# EAGLE design module (EAGLE 7.7.0)
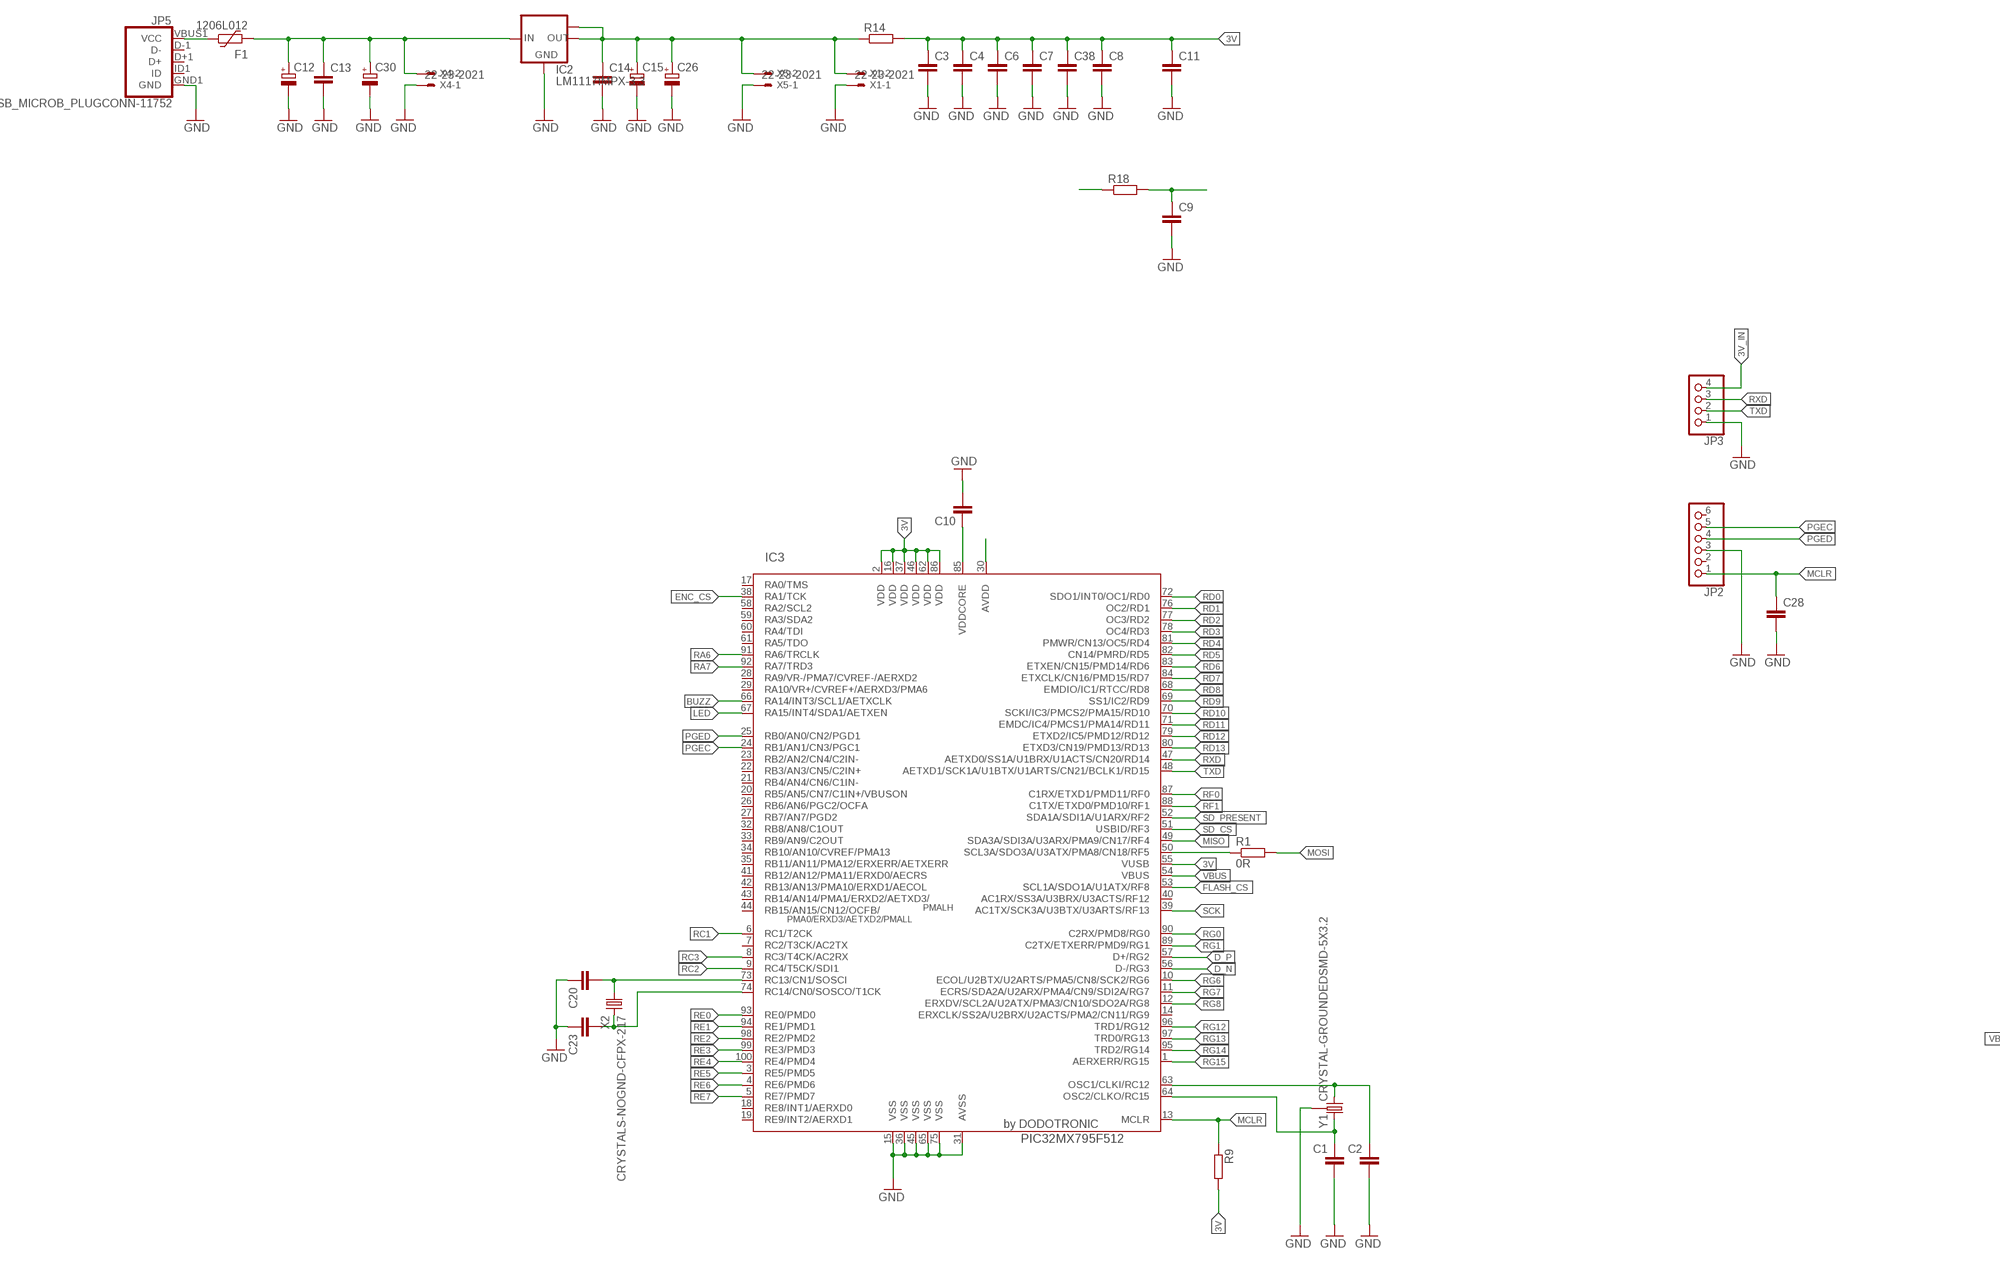
[diagram p0: schematic, sheet 1, part 1 of 3]
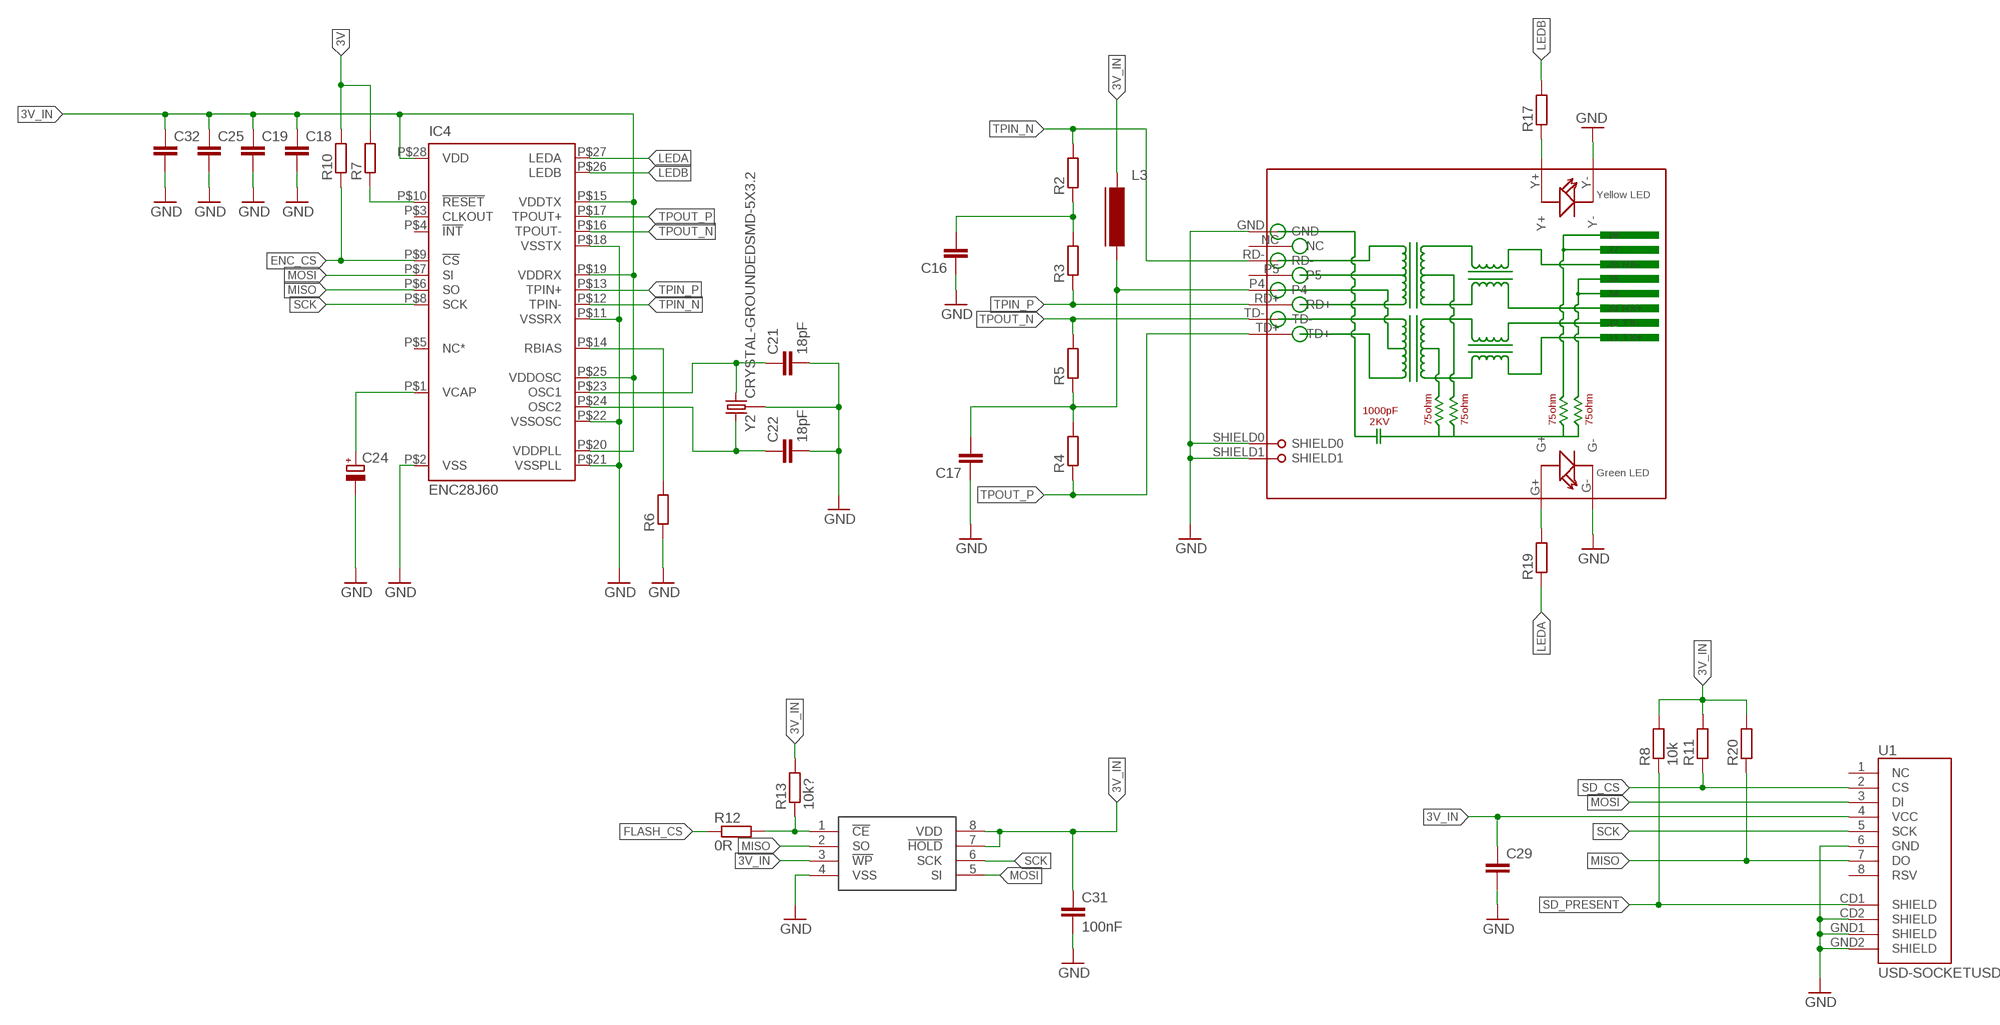
[diagram p1: schematic, sheet 1, part 2 of 3]
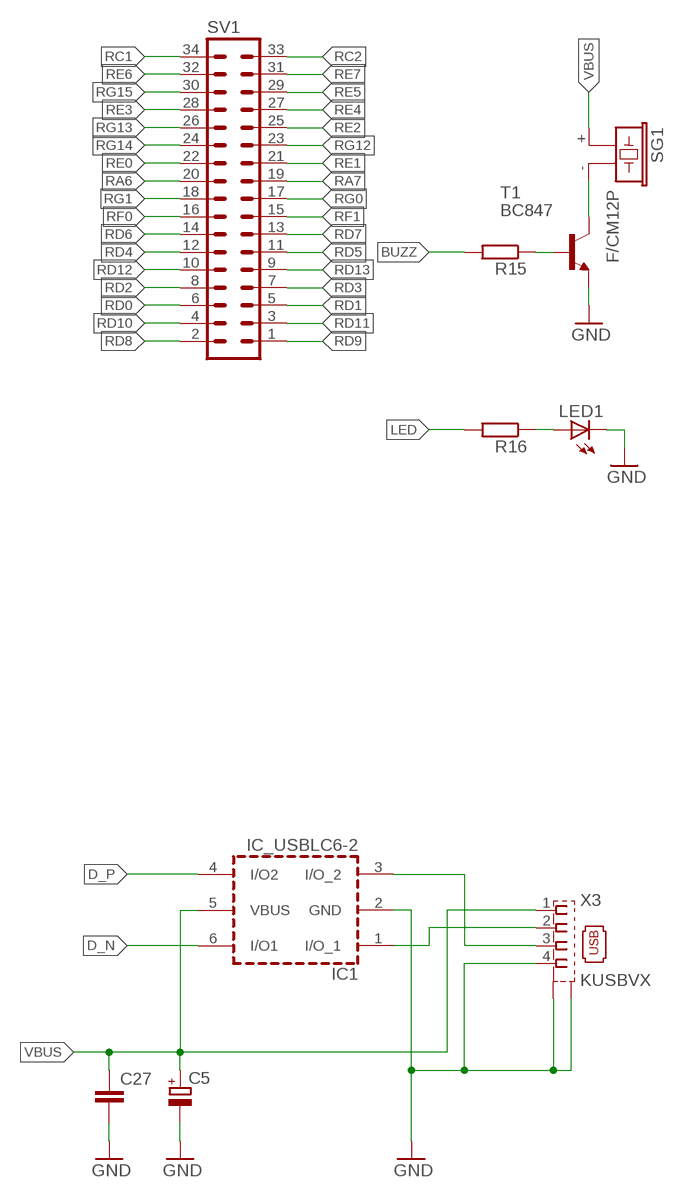
[diagram p2: schematic, sheet 1, part 3 of 3]

## Parts
C1  C-EUC0603  [C0603]
C2  C-EUC0603  [C0603]
C3  C-EUC0402  [C0402]
C4  C-EUC0402  [C0402]
C5  CPOL-EUSMCA  [SMC_A]
C6  C-EUC0402  [C0402]
C7  C-EUC0402  [C0402]
C8  C-EUC0402  [C0402]
C9  C-EUC0402  [C0402]
C10  C-EUC0603  [C0603]
C11  C-EUC0402  [C0402]
C12  CPOL-EUSMCB  [SMC_B]
C13  C-EUC0603  [C0603]
C14  C-EUC0603  [C0603]
C15  CPOL-EUSMCB  [SMC_B]
C16  C-EUC0603  [C0603]
C17  C-EUC0603  [C0603]
C18  C-EUC0402  [C0402]
C19  C-EUC0603  [C0603]
C20  C-EUC0603  [C0603]
C21  18pF  C-EUC0603  [C0603]
C22  18pF  C-EUC0603  [C0603]
C23  C-EUC0603  [C0603]
C24  CPOL-EUSMCA  [SMC_A]
C25  C-EUC0603  [C0603]
C26  CPOL-EUSMCA  [SMC_A]
C27  C-EUC0603  [C0603]
C28  C-EUC0603  [C0603]
C29  C-EUC0603  [C0603]
C30  CPOL-EUSMCA  [SMC_A]
C31  100nF  C-EUC0603  [C0603]
C32  C-EUC0402  [C0402]
C38  C-EUC0603  [C0603]
F1  1206L012  [1206L]
IC1  IC_USBLC6-2  [SOT-23-6L]
IC2  LM1117IMPX-3.3  [SOT223]
IC3  PIC32MX795F512  [TQFP100_12X12]
IC4  ENC28J60  [TSSOP28W]
JP2  PINHD-1X6  [1X06]
JP3  PINHD-1X4  [1X04]
JP5  USB_MICROB_PLUGCONN-11752  [USB-B-MICRO-SMD_V03]
L3  FERRITE-0805  [FB805]
LED1  LED3MM  [LED3MM]
R1  0R  R-EU_R0603  [R0603]
R2  R-EU_R0603  [R0603]
R3  R-EU_R0603  [R0603]
R4  R-EU_R0603  [R0603]
R5  R-EU_R0603  [R0603]
R6  R-EU_R0805  [R0805]
R7  R-EU_R0402  [R0402]
R8  10k  R-EU_R0603  [R0603]
R9  R-EU_R0603  [R0603]
R10  R-EU_R0603  [R0603]
R11  R-EU_R0603  [R0603]
R12  0R  R-EU_R0603  [R0603]
R13  10k?  R-EU_R0603  [R0603]
R14  R-EU_R1206  [R1206]
R15  R-EU_R0603  [R0603]
R16  R-EU_R0603  [R0603]
R17  R-EU_R1206  [R1206]
R18  R-EU_R0805  [R0805]
R19  R-EU_R1206  [R1206]
R20  R-EU_R0603  [R0603]
RJ1  HR911105A  [HR911105A]
SG1  F/CM12P  [F/CM12P]
SV1  ML34L  [ML34L]
T1  BC847  [SOT23]
U1  USD-SOCKETUSD  [USD-SOCKET-PP]
U$2  SST25VF016BSO8M  [SO-08M]
X1  22-23-2021  [22-23-2021]
X2  CRYSTALS-NOGND-CFPX-217  [3.2X1.5-2-PAD]
X3  KUSBVX  [KUSBVX]
X4  22-23-2021  [22-23-2021]
X5  22-23-2021  [22-23-2021]
Y1  CRYSTAL-GROUNDEDSMD-5X3.2  [CRYSTAL-SMD-5X3.2-4PAD]
Y2  CRYSTAL-GROUNDEDSMD-5X3.2  [CRYSTAL-SMD-5X3.2-4PAD]

## Nets
3V: C3.1 C4.1 C6.1 C7.1 C8.1 C11.1 C38.1 IC3.2(VDD) IC3.16(VDD) IC3.37(VDD) IC3.46(VDD) IC3.55(VUSB) IC3.62(VDD) IC3.86(VDD) R7.2 R9.2 R10.2 R14.2 R18.1
3V_IN: C14.1 C15.+ C18.1 C19.1 C25.1 C26.+ C29.1 C31.1 C32.1 IC2.2(OUT) IC2.TAB(OUT1) IC4.P$15(VDDTX) IC4.P$19(VDDRX) IC4.P$20(VDDPLL) IC4.P$25(VDDOSC) IC4.P$28(VDD) JP3.4 L3.1 R8.2 R11.2 R13.2 R14.1 R20.2 U1.4(VCC) U$2.3(!WP) U$2.7(!HOLD) U$2.8(VDD) X1.2 X5.2
AN_3V: C9.1 IC3.30(AVDD) R18.2
BUZZ: IC3.66(RA14/INT3/SCL1/AETXCLK) R15.2
CE1: R12.2 R13.1 U$2.1(!CE)
D2_N: IC1.1(I/O_1) X3.2
D2_P: IC1.3(I/O_2) X3.3
D_N: IC1.6(I/O1) IC3.56(D-/RG3)
D_P: IC1.4(I/O2) IC3.57(D+/RG2)
ENC_CS: IC3.38(RA1/TCK) IC4.P$9(!CS) R10.1
ENC_RST: IC4.P$10(!RESET) R7.1
FLASH_CS: IC3.53(SCL1A/SDO1A/U1ATX/RF8) R12.1
GND: C1.2 C2.2 C3.2 C4.2 C5.- C6.2 C7.2 C8.2 C9.2 C10.2 C11.2 C12.- C13.2 C14.2 C15.- C16.1 C17.1 C18.2 C19.2 C20.1 C21.2 C22.2 C23.1 C24.- C25.2 C26.- C27.2 C28.2 C29.2 C30.- C31.2 C32.2 C38.2 IC1.2(GND) IC2.1(GND) IC3.15(VSS) IC3.31(AVSS) IC3.36(VSS) IC3.45(VSS) IC3.65(VSS) IC3.75(VSS) IC4.P$2(VSS) IC4.P$11(VSSRX) IC4.P$18(VSSTX) IC4.P$21(VSSPLL) IC4.P$22(VSSOSC) JP2.3 JP3.1 JP5.GND1(GND) LED1.K(C) R6.1 RJ1.G- RJ1.GND RJ1.SHIELD0 RJ1.SHIELD1 RJ1.Y- T1.2(E) U1.6(GND) U1.CD2(SHIELD) U1.GND1(SHIELD) U1.GND2(SHIELD) U$2.4(VSS) X1.1 X3.4 X3.M1(S1) X3.M2(S2) X4.1 X5.1 Y1.2 Y1.4 Y2.2 Y2.4
LED: IC3.67(RA15/INT4/SDA1/AETXEN) R16.2
LEDA: IC4.P$27(LEDA) R19.1
LEDB: IC4.P$26(LEDB) R17.2
MCLR: C28.1 IC3.13(MCLR) JP2.1 R9.1
MISO: IC3.49(SDA3A/SDI3A/U3ARX/PMA9/CN17/RF4) IC4.P$6(SO) R20.1 U1.7(DO) U$2.2(SO)
MOSI: IC4.P$7(SI) R1.2 U1.3(DI) U$2.5(SI)
N$1: SG1.- T1.3(C)
N$2: C16.2 R2.1 R3.2
N$3: R15.1 T1.1(B)
N$4: LED1.A R16.1
N$5: IC3.50(SCL3A/SDO3A/U3ATX/PMA8/CN18/RF5) R1.1
N$6: C17.2 L3.2 R4.2 R5.1 RJ1.P4
N$10: C10.1 IC3.85(VDDCORE)
N$12: IC4.P$14(RBIAS) R6.2
N$17: F1.1 JP5.VBUS1(VCC)
N$22: C21.1 IC4.P$23(OSC1) Y2.1
N$23: C22.1 IC4.P$24(OSC2) Y2.3
N$29: C24.+ IC4.P$1(VCAP)
N$30: R17.1 RJ1.Y+
N$31: R19.2 RJ1.G+
OSC1: C2.1 IC3.63(OSC1/CLKI/RC12) Y1.1
OSC2: C1.1 IC3.64(OSC2/CLKO/RC15) Y1.3
PGEC: IC3.24(RB1/AN1/CN3/PGC1) JP2.5
PGED: IC3.25(RB0/AN0/CN2/PGD1) JP2.4
RA6: IC3.91(RA6/TRCLK) SV1.20
RA7: IC3.92(RA7/TRD3) SV1.19
RC1: IC3.6(RC1/T2CK) SV1.34
RC2: IC3.9(RC4/T5CK/SDI1) SV1.33
RC3: IC3.8(RC3/T4CK/AC2RX)
RD0: IC3.72(SDO1/INT0/OC1/RD0) SV1.6
RD1: IC3.76(OC2/RD1) SV1.5
RD2: IC3.77(OC3/RD2) SV1.8
RD3: IC3.78(OC4/RD3) SV1.7
RD4: IC3.81(PMWR/CN13/OC5/RD4) SV1.12
RD5: IC3.82(CN14/PMRD/RD5) SV1.11
RD6: IC3.83(ETXEN/CN15/PMD14/RD6) SV1.14
RD7: IC3.84(ETXCLK/CN16/PMD15/RD7) SV1.13
RD8: IC3.68(EMDIO/IC1/RTCC/RD8) SV1.2
RD9: IC3.69(SS1/IC2/RD9) SV1.1
RD10: IC3.70(SCKI/IC3/PMCS2/PMA15/RD10) SV1.4
RD11: IC3.71(EMDC/IC4/PMCS1/PMA14/RD11) SV1.3
RD12: IC3.79(ETXD2/IC5/PMD12/RD12) SV1.10
RD13: IC3.80(ETXD3/CN19/PMD13/RD13) SV1.9
RE0: IC3.93(RE0/PMD0) SV1.22
RE1: IC3.94(RE1/PMD1) SV1.21
RE2: IC3.98(RE2/PMD2) SV1.25
RE3: IC3.99(RE3/PMD3) SV1.28
RE4: IC3.100(RE4/PMD4) SV1.27
RE5: IC3.3(RE5/PMD5) SV1.29
RE6: IC3.4(RE6/PMD6) SV1.32
RE7: IC3.5(RE7/PMD7) SV1.31
RF0: IC3.87(C1RX/ETXD1/PMD11/RF0) SV1.16
RF1: IC3.88(C1TX/ETXD0/PMD10/RF1) SV1.15
RG0: IC3.90(C2RX/PMD8/RG0) SV1.17
RG1: IC3.89(C2TX/ETXERR/PMD9/RG1) SV1.18
RG6: IC3.10(ECOL/U2BTX/U2ARTS/PMA5/CN8/SCK2/RG6)
RG7: IC3.11(ECRS/SDA2A/U2ARX/PMA4/CN9/SDI2A/RG7)
RG8: IC3.12(ERXDV/SCL2A/U2ATX/PMA3/CN10/SDO2A/RG8)
RG12: IC3.96(TRD1/RG12) SV1.23
RG13: IC3.97(TRD0/RG13) SV1.26
RG14: IC3.95(TRD2/RG14) SV1.24
RG15: IC3.1(AERXERR/RG15) SV1.30
RXD: IC3.47(AETXD0/SS1A/U1BRX/U1ACTS/CN20/RD14) JP3.3
SCK: IC3.39(AC1TX/SCK3A/U3BTX/U3ARTS/RF13) IC4.P$8(SCK) U1.5(SCK) U$2.6(SCK)
SD_CS: IC3.51(USBID/RF3) R11.1 U1.2(CS)
SD_PRESENT: IC3.52(SDA1A/SDI1A/U1ARX/RF2) R8.1 U1.CD1(SHIELD)
SOSCI: C20.2 IC3.73(RC13/CN1/SOSCI) X2.1
SOSCO: C23.2 IC3.74(RC14/CN0/SOSCO/T1CK) X2.2
TPIN_N: IC4.P$12(TPIN-) R2.2 RJ1.RD-
TPIN_P: IC4.P$13(TPIN+) R3.1 RJ1.RD+
TPOUT_N: IC4.P$16(TPOUT-) R5.2 RJ1.TD-
TPOUT_P: IC4.P$17(TPOUT+) R4.1 RJ1.TD+
TXD: IC3.48(AETXD1/SCK1A/U1BTX/U1ARTS/CN21/BCLK1/RD15) JP3.2
VBUS: C5.+ C12.+ C13.1 C27.1 C30.+ F1.2 IC1.5(VBUS) IC2.3(IN) IC3.54(VBUS) SG1.+ X3.1 X4.2
Unconnected: IC3.7(RC2/T3CK/AC2TX) IC3.14(ERXCLK/SS2A/U2BRX/U2ACTS/PMA2/CN11/RG9) IC3.17(RA0/TMS) IC3.18(RE8/INT1/AERXD0) IC3.19(RE9/INT2/AERXD1) IC3.20(RB5/AN5/CN7/C1IN+/VBUSON) IC3.21(RB4/AN4/CN6/C1IN-) IC3.22(RB3/AN3/CN5/C2IN+) IC3.23(RB2/AN2/CN4/C2IN-) IC3.26(RB6/AN6/PGC2/OCFA) IC3.27(RB7/AN7/PGD2) IC3.28(RA9/VR-/PMA7/CVREF-/AERXD2) IC3.29(RA10/VR+/CVREF+/AERXD3/PMA6) IC3.32(RB8/AN8/C1OUT) IC3.33(RB9/AN9/C2OUT) IC3.34(RB10/AN10/CVREF/PMA13) IC3.35(RB11/AN11/PMA12/ERXERR/AETXERR) IC3.40(AC1RX/SS3A/U3BRX/U3ACTS/RF12) IC3.41(RB12/AN12/PMA11/ERXD0/AECRS) IC3.42(RB13/AN13/PMA10/ERXD1/AECOL) IC3.43(RB14/AN14/PMA1/ERXD2/AETXD3/) IC3.44(RB15/AN15/CN12/OCFB/) IC3.58(RA2/SCL2) IC3.59(RA3/SDA2) IC3.60(RA4/TDI) IC3.61(RA5/TDO) IC4.P$3(CLKOUT) IC4.P$4(!INT) IC4.P$5(NC*) JP2.2 JP2.6 JP5.D+1(D+) JP5.D-1(D-) JP5.ID1(ID) RJ1.NC RJ1.P5 U1.1(NC) U1.8(RSV)

## Library data of the parts
C1-C4 C6-C11 C13 C14 C16-C23 C25 C27-C29 C31 C32 C38 = rcl:C-EU: CAPACITOR, European symbol
C5 C12 C15 C24 C26 C30 = rcl:CPOL-EU: POLARIZED CAPACITOR, European symbol
F1 = polyfuse-smd_10:?: Polyfuse Resettable PTC Source: http://www.littelfuse.com/products/resettable-ptcs.aspx; MF: Littelfuse; MPN: 1206L012; OC_FARNELL: 1596988; OC_NEWARK: 05M2298
IC1 = dp_devices:IC_USBLC6-2
IC2 = lm1117:LM1117IMPX-*
IC3 = DodoMicroR3:PIC32MX795F512: USB, CAN and Ethernet 32-bit Flash Microcontroller
IC4 = microchip:ENC28J60: Stand-Alone Ethernet Controller with SPI Interface Source: http://ww1.microchip.com/downloads/en/DeviceDoc/39662c.pdf
JP2 = pinhead:PINHD-1X6: PIN HEADER
JP3 = pinhead:PINHD-1X4: PIN HEADER
JP5 = SparkFun-Connectors:USB_MICROB_PLUG: USB Micro-B connectors Some male, some female. Watch your step!; PROD_ID: CONN-11752
L3 = dp_devices:FERRITE: Ferrite bead in various packages
LED1 = led:LED: LED OSRAM: - CHIPLED LG R971, LG N971, LY N971, LG Q971, LY Q971, LO R971, LY R971 LH N974, LH R974 LS Q976, LO Q976, LY Q976 LO Q996 - Hyper CHIPLED LW Q18S LB Q993, LB Q99A, LB R99A - SideLED LS A670, LO A670, LY A670, LG A670, LP A670 LB A673, LV A673, LT A673, LW A673 LH A674 LY A675 LS A676, LA A676, LO A676, LY A676, LW A676 LS A679, LY A679, LG A679 - Hyper Micro SIDELED® LS Y876, LA Y876, LO Y876, LY Y876 LT Y87S - SmartLED LW L88C, LW L88S LB L89C, LB L89S, LG L890 LS L89K, LO L89K, LY L89K LS L896, LA L896, LO L896, LY L896 - TOPLED LS T670, LO T670, LY T670, LG T670, LP T670 LSG T670, LSP T670, LSY T670, LOP T670, LYG T670 LG T671, LOG T671, LSG T671 LB T673, LV T673, LT T673, LW T673 LH T674 LS T676, LA T676, LO T676, LY T676, LB T676, LH T676, LSB T676, LW T676 LB T67C, LV T67C, LT T67C, LS T67K, LO T67K, LY T67K, LW E67C LS E67B, LA E67B, LO E67B, LY E67B, LB E67C, LV E67C, LT E67C LW T67C LS T679, LY T679, LG T679 LS T770, LO T770, LY T770, LG T770, LP T770 LB T773, LV T773, LT T773, LW T773 LH T774 LS E675, LA E675, LY E675, LS T675 LS T776, LA T776, LO T776, LY T776, LB T776 LHGB T686 LT T68C, LB T68C - Hyper Mini TOPLED® LB M676 - Mini TOPLED Santana® LG M470 LS M47K, LO M47K, LY M47K Source: http://www.osram.convergy.de LUXEON: - LUMILED® LXK2-PW12-R00, LXK2-PW12-S00, LXK2-PW14-U00, LXK2-PW14-V00 LXK2-PM12-R00, LXK2-PM12-S00, LXK2-PM14-U00 LXK2-PE12-Q00, LXK2-PE12-R00, LXK2-PE12-S00, LXK2-PE14-T00, LXK2-PE14-U00 LXK2-PB12-K00, LXK2-PB12-L00, LXK2-PB12-M00, LXK2-PB14-N00, LXK2-PB14-P00, LXK2-PB14-Q00 LXK2-PR12-L00, LXK2-PR12-M00, LXK2-PR14-Q00, LXK2-PR14-R00 LXK2-PD12-Q00, LXK2-PD12-R00, LXK2-PD12-S00 LXK2-PH12-R00, LXK2-PH12-S00 LXK2-PL12-P00, LXK2-PL12-Q00, LXK2-PL12-R00 Source: www.luxeon.com KINGBRIGHT: KA-3528ASYC Source: www.kingbright.com
R1-R20 = rcl:R-EU_: RESISTOR, European symbol
RJ1 = hanrun:HR911105A
SG1 = buzzer:F/CM12P: BUZZER Source: Buerklin; OC_FARNELL: unknown; OC_NEWARK: unknown
SV1 = con-harting-ml:ML34: HARTING; OC_FARNELL: unknown; OC_NEWARK: unknown
T1 = transistor:BC847: NPN TRANSISTOR
U1 = SparkFun-Connectors:USD-SOCKET: microSD Socket Push-push type uSD socket. Schematic element and footprint production proven. Spark Fun Electronics SKU : PRT-00127. tDoc lines correctly indicate media card edge positions when inserting (unlocked, locked, depressed).
U$2 = mw:SST25VF016B
X1 X4 X5 = con-molex:22-23-2021: .100" (2.54mm) Center Header - 2 Pin; MF: MOLEX; MPN: 22-23-2021; OC_FARNELL: 1462926; OC_NEWARK: 25C3832
X2 = IQD-Frequency-Products:CRYSTALS-NOGND: CRYSTALS CAN NOT GROUNDED
X3 = con-kycon:KUSBVX: Vertical,Top Entry Universal Serial Bus Connector KUSBVX Series Source: KYCON Sibalco USB vertical socket KUSBV.pdf
Y1 Y2 = SparkFun-Clocks:CRYSTAL-GROUNDED: Crystals w/ Ground Pin (Generic) These are passive quartz crystals, which can be used as a clock source for a microcontroller. Crystal's are usually two-terminal devices. A third terminal may be optionally connected to ground, as recommended by the manufaturer.

## Board
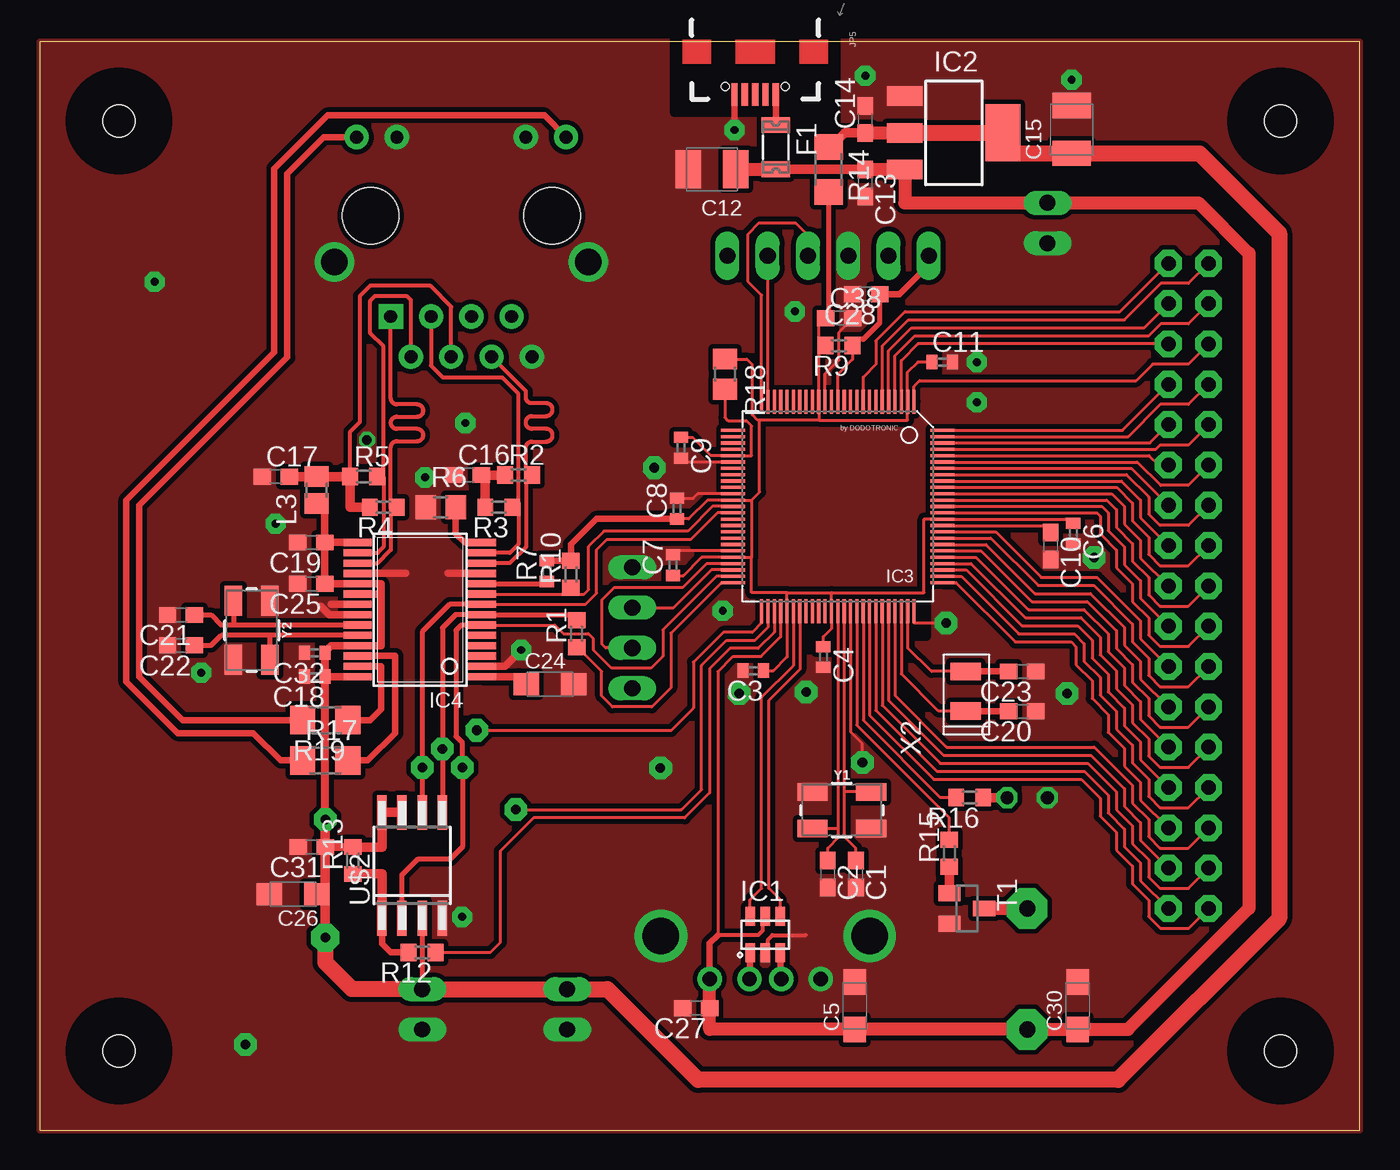
[diagram p3: board, top side]
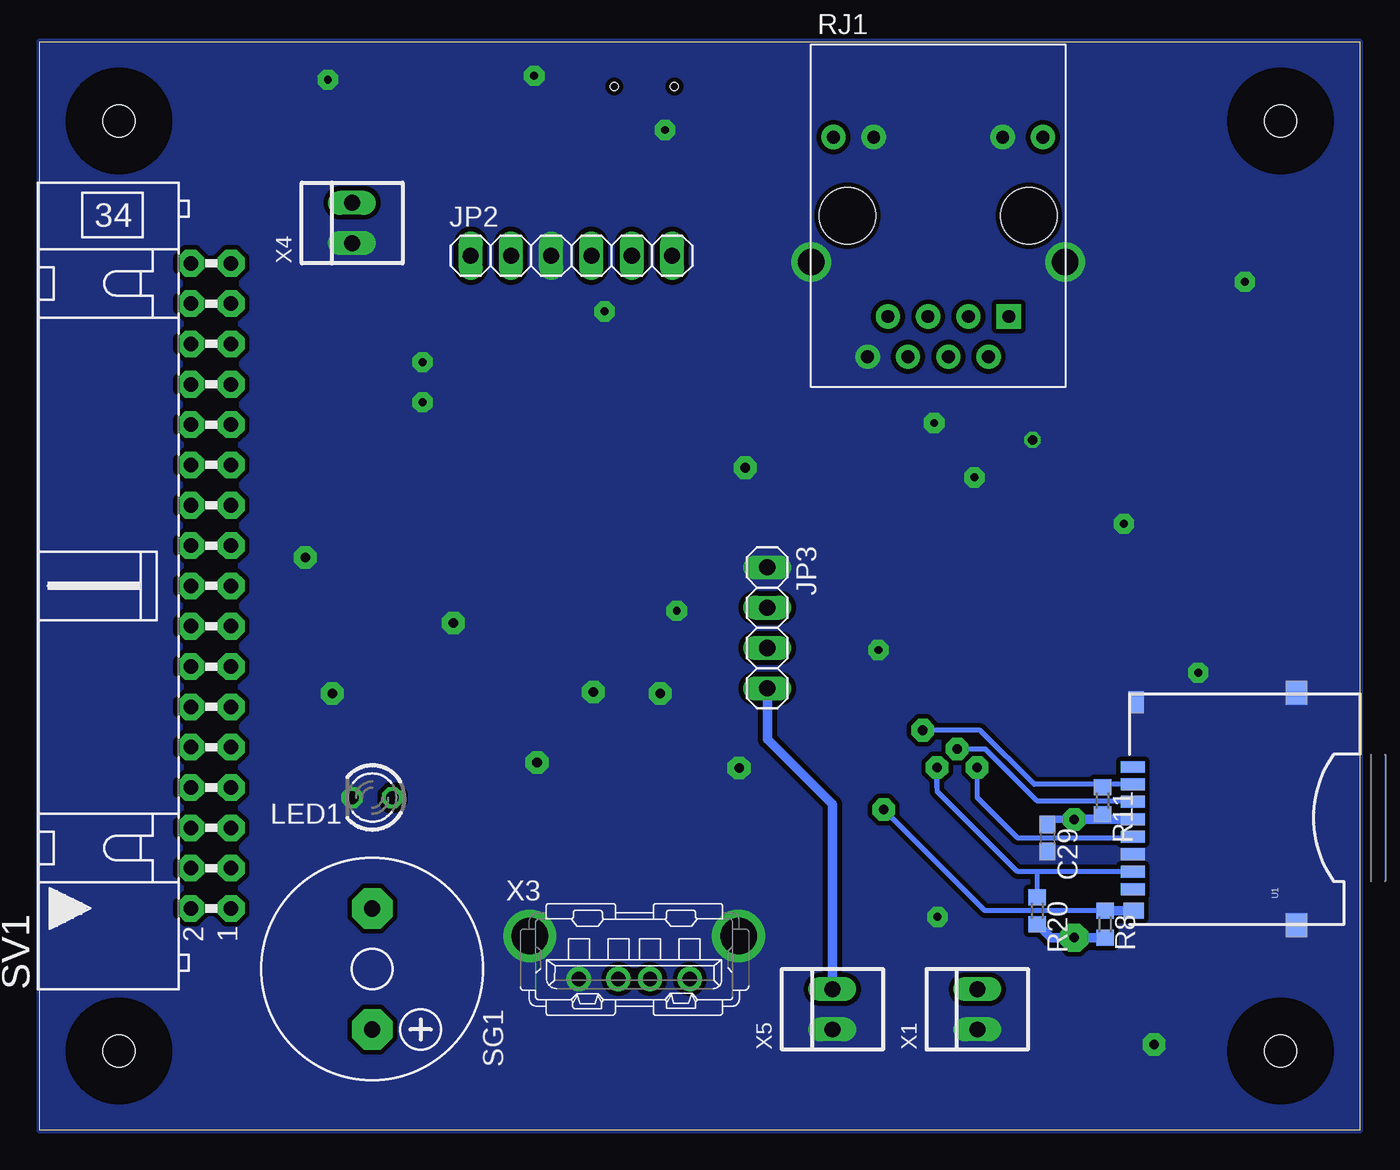
[diagram p4: board, bottom side, seen from below]

Size 83.19 x 68.58 mm. Coordinates in mm from the lower left corner, seen from the top.
Outline: 0,0 83.19,0 83.19,68.58 0,68.58 0,0
Copper layers (1*16): Top 0.035mm / dielectric 1.5mm / Bottom 0.035mm
Design rules "default *": minimum track width 10mil, minimum drill 24mil, track to track 8mil, track to pad 8mil, pad to pad 8mil, via to via 8mil, smd to smd 8mil, copper to edge 0mil, drill to drill 8mil, minimum pad ring 10mil, minimum via ring 8mil, stop-mask expansion 4mil, vias tented up to drill 0mil, thermal gap 10mil
Holes 2 mm at 5,5 78.19,5 78.19,63.58 5,63.58
tRestrict: area 55.1,31.1 to 55.9,33.9; area 44.5,11.4 to 47,13.3; area 19.1,28.3 to 20.9,37.3; area 27,28.3 to 28.8,37.3; area 41.3,36.8 to 43.2,37.5; area 45.5,61 to 47.3,62.8; area 40,64.1 to 50.2,68.6; area 47.6,61 to 50.2,64.1; area 2,2 to 8,8; area 75.1,2 to 81.2,8; area 75.1,60.5 to 81.2,66.6; area 2,60.5 to 8,66.6
bRestrict: area 2,2 to 8,8; area 75.1,2 to 81.2,8; area 75.1,60.5 to 81.2,66.6; area 2,60.5 to 8,66.6

### Footprints (pad centres in the part's own frame; a part is rotated, then mirrored left to right if it is on the bottom)
C0603 = smd 1.1 x 1: 1 -0.85,0; 2 0.85,0
C0402 = smd 0.7 x 0.9: 1 -0.65,0; 2 0.65,0
SMC_A = smd 1.6 x 1.4: + -1.5,0; - 1.5,0
SMC_B = smd 1.6 x 2.4: + -1.5,0; - 1.5,0
1206L = smd 1 x 1.8: 1 -1.4,0; 2 1.4,0
SOT-23-6L = smd 0.6 x 1.2: 1 -0.95,-2.3; 2 0,-2.3; 3 0.95,-2.3; 4 0.95,0; 5 0,0; 6 -0.95,0
SOT223 = smd 1.219 x 2.235: 1 -2.311,-3.099; 2 0,-3.099; 3 2.311,-3.099 | smd 3.6 x 2.2: TAB 0,3.099
TQFP100_12X12 = smd 0.2 x 1.5: 1 -4.8,-6.6; 2 -4.4,-6.6; 3 -4,-6.6; 4 -3.6,-6.6; 5 -3.2,-6.6; 6 -2.8,-6.6; 7 -2.4,-6.6; 8 -2,-6.6; 9 -1.6,-6.6; 10 -1.2,-6.6; 11 -0.8,-6.6; 12 -0.4,-6.6; 13 0,-6.6; 14 0.4,-6.6; 15 0.8,-6.6; 16 1.2,-6.6; 17 1.6,-6.6; 18 2,-6.6; 19 2.4,-6.6; 20 2.8,-6.6; 21 3.2,-6.6; 22 3.6,-6.6; 23 4,-6.6; 24 4.4,-6.6; 25 4.8,-6.6; 51 4.8,6.6; 52 4.4,6.6; 53 4,6.6; 54 3.6,6.6; 55 3.2,6.6; 56 2.8,6.6; 57 2.4,6.6; 58 2,6.6; 59 1.6,6.6; 60 1.2,6.6; 61 0.8,6.6; 62 0.4,6.6; 63 0,6.6; 64 -0.4,6.6; 65 -0.8,6.6; 66 -1.2,6.6; 67 -1.6,6.6; 68 -2,6.6; 69 -2.4,6.6; 70 -2.8,6.6; 71 -3.2,6.6; 72 -3.6,6.6; 73 -4,6.6; 74 -4.4,6.6; 75 -4.8,6.6 | smd 1.5 x 0.2: 26 6.6,-4.8; 27 6.6,-4.4; 28 6.6,-4; 29 6.6,-3.6; 30 6.6,-3.2; 31 6.6,-2.8; 32 6.6,-2.4; 33 6.6,-2; 34 6.6,-1.6; 35 6.6,-1.2; 36 6.6,-0.8; 37 6.6,-0.4; 38 6.6,0; 39 6.6,0.4; 40 6.6,0.8; 41 6.6,1.2; 42 6.6,1.6; 43 6.6,2; 44 6.6,2.4; 45 6.6,2.8; 46 6.6,3.2; 47 6.6,3.6; 48 6.6,4; 49 6.6,4.4; 50 6.6,4.8; 76 -6.6,4.8; 77 -6.6,4.4; 78 -6.6,4; 79 -6.6,3.6; 80 -6.6,3.2; 81 -6.6,2.8; 82 -6.6,2.4; 83 -6.6,2; 84 -6.6,1.6; 85 -6.6,1.2; 86 -6.6,0.8; 87 -6.6,0.4; 88 -6.6,0; 89 -6.6,-0.4; 90 -6.6,-0.8; 91 -6.6,-1.2; 92 -6.6,-1.6; 93 -6.6,-2; 94 -6.6,-2.4; 95 -6.6,-2.8; 96 -6.6,-3.2; 97 -6.6,-3.6; 98 -6.6,-4; 99 -6.6,-4.4; 100 -6.6,-4.8
TSSOP28W = smd 0.45 x 1.75: P$1 0,-0.65; P$2 0.65,-0.65; P$3 1.3,-0.65; P$4 1.95,-0.65; P$5 2.6,-0.65; P$6 3.25,-0.65; P$7 3.9,-0.65; P$8 4.55,-0.65; P$9 5.2,-0.65; P$10 5.85,-0.65; P$11 6.5,-0.65; P$12 7.15,-0.65; P$13 7.8,-0.65; P$14 8.45,-0.65; P$15 8.45,7.2; P$16 7.8,7.2; P$17 7.15,7.2; P$18 6.5,7.2; P$19 5.85,7.2; P$20 5.2,7.2; P$21 4.55,7.2; P$22 3.9,7.2; P$23 3.25,7.2; P$24 2.6,7.2; P$25 1.95,7.2; P$26 1.3,7.2; P$27 0.65,7.2; P$28 0,7.2
1X06 = drill 1.016 long: 1 -6.35,0; 2 -3.81,0; 3 -1.27,0; 4 1.27,0; 5 3.81,0; 6 6.35,0
1X04 = drill 1.016 long: 1 -3.81,0; 2 -1.27,0; 3 1.27,0; 4 3.81,0
USB-B-MICRO-SMD_V03 = smd 1.4 x 0.4: D+1 2.7,0; D-1 2.7,0.65; GND1 2.7,-1.3; ID1 2.7,-0.65; VBUS1 2.7,1.3 | hole 0.5: 2.2,1.9; 2.2,-1.9
FB805 = smd 1.3 x 1.5: 1 -0.85,0; 2 0.85,0
LED3MM = drill 0.813 octagon: A -1.27,0; K 1.27,0
R0603 = smd 1 x 1.1: 1 -0.85,0; 2 0.85,0
R0805 = smd 1.3 x 1.5: 1 -0.95,0; 2 0.95,0
R0402 = smd 0.7 x 0.9: 1 -0.65,0; 2 0.65,0
R1206 = smd 1.6 x 1.803: 1 -1.422,0; 2 1.422,0
HR911105A = drill 0.813 pad 1.524: G+ 4.953,-6.604; G- 4.953,-4.064; GND -8.89,4.445; NC -6.35,3.175; P4 -8.89,-0.635; P5 -6.35,0.635; RD+ -6.35,-1.905; RD- -8.89,1.905; TD- -8.89,-3.175; Y+ 4.953,6.604; Y- 4.953,4.064 | drill 1.651 pad 2.159: SHIELD0 -2.921,8.001; SHIELD1 -2.921,-8.001 | drill 0.813 pad 1.524 square: TD+ -6.35,-4.445 | hole 3.556: 0,-5.715; 0,5.715
F/CM12P = drill 1.016 pad 2.54 octagon: + 3.81,0; - -3.81,0
ML34L = drill 0.914 pad 1.676 octagon: 1 -20.32,-1.27; 2 -20.32,1.27; 3 -17.78,-1.27; 4 -17.78,1.27; 5 -15.24,-1.27; 6 -15.24,1.27; 7 -12.7,-1.27; 8 -12.7,1.27; 9 -10.16,-1.27; 10 -10.16,1.27; 11 -7.62,-1.27; 12 -7.62,1.27; 13 -5.08,-1.27; 14 -5.08,1.27; 15 -2.54,-1.27; 16 -2.54,1.27; 17 0,-1.27; 18 0,1.27; 19 2.54,-1.27; 20 2.54,1.27; 21 5.08,-1.27; 22 5.08,1.27; 23 7.62,-1.27; 24 7.62,1.27; 25 10.16,-1.27; 26 10.16,1.27; 27 12.7,-1.27; 28 12.7,1.27; 29 15.24,-1.27; 30 15.24,1.27; 31 17.78,-1.27; 32 17.78,1.27; 33 20.32,-1.27; 34 20.32,1.27
SOT23 = smd 1 x 1.4: 1 -0.95,-1.1; 2 0.95,-1.1; 3 0,1.1
USD-SOCKET-PP = smd 0.75 x 1.5: 1 3.2,14.3; 2 2.1,14.3; 3 1,14.3; 4 -0.1,14.3; 5 -1.2,14.3; 6 -2.3,14.3; 7 -3.4,14.3; 8 -4.5,14.3 | smd 1 x 1.3: CD1 -5.85,14.25 | smd 1.4 x 1: CD2 7.275,14.1 | smd 1.5 x 1.35: GND1 -6.775,4; GND2 7.875,4
SO-08M = smd 0.6 x 2.2: 1 -1.905,-3.33; 2 -0.635,-3.33; 3 0.635,-3.33; 4 1.905,-3.33; 5 1.905,3.33; 6 0.635,3.33; 7 -0.635,3.33; 8 -1.905,3.33
22-23-2021 = drill 1 long: 1 -1.27,0; 2 1.27,0
3.2X1.5-2-PAD = smd 1.1 x 1.9: 1 -1.25,0; 2 1.25,0
KUSBVX = drill 0.9 pad 1.524: 1 3.5,0; 2 1,0; 3 -1,0; 4 -3.5,0 | drill 2.3 pad 2.8: M1 -6.57,2.71; M2 6.57,2.71
CRYSTAL-SMD-5X3.2-4PAD = smd 1.9 x 1.1: 1 -1.85,-1.15; 2 1.85,-1.15; 3 1.85,1.15; 4 -1.85,1.15

### Placement (x,y rotation side)
C1  51.43,16.13 270 top
C2  49.66,16.13 270 top
C3  44.96,28.96 180 top
C4  49.38,29.81 270 top
C5  51.36,7.85 90 top
C6  65.13,37.6 270 top
C7  39.9,35.59 90 top
C8  40.16,39.15 90 top
C9  40.41,42.99 270 top
C10  63.7,36.8 270 top
C11  56.86,48.39 0 top
C12  42.37,60.53 180 top
C13  52.02,59.66 270 top
C14  52.02,63.68 90 top
C15  65.02,63.04 90 top
C16  26.97,41.27 0 top
C17  14.88,41.17 0 top
C18  17.35,28.57 180 top
C19  17.12,37.02 180 top
C20  61.9,26.4 180 top
C21  8.92,32.46 180 top
C22  8.92,30.54 180 top
C23  61.9,28.9 180 top
C24  32.17,28.1 0 top
C25  17.11,34.43 180 top
C26  15.98,14.86 180 top
C27  41.37,7.7 180 top
C28  52.09,52.67 180 top
C29  19.68,18.41 270 bottom
C30  65.41,7.85 90 top
C31  17.14,17.84 180 top
C32  17.35,30.07 180 top
C38  50.39,51.15 0 top
F1  46.38,61.93 270 top
IC1  45.72,13.49 0 top
IC2  57.61,62.83 270 top
IC3  50.29,39.29 180 top
IC4  27.23,28.57 90 top
JP2  49.68,55.08 0 bottom
JP3  37.34,31.65 270 bottom
JP5  45.09,67.94 270 top
L3  17.44,40.32 90 top
LED1  62.23,20.95 180 bottom
R1  33.83,31.28 90 top
R2  30.18,41.27 0 top
R3  28.93,39.24 180 top
R4  21.65,39.24 180 top
R5  20.42,41.17 0 top
R6  25.27,39.24 0 top
R7  31.95,35.22 90 top
R8  16.05,12.98 270 bottom
R9  50.37,49.42 180 top
R10  33.48,35.03 90 top
R11  16.21,20.75 270 bottom
R12  24.1,11.2 180 top
R13  19.74,16.99 90 top
R14  49.71,60.53 270 top
R15  57.32,17.45 90 top
R16  58.6,20.95 180 top
R17  18,23.29 0 top
R18  43.18,47.62 270 top
R19  18,25.83 180 top
R20  20.32,13.83 270 bottom
RJ1  26.57,57.61 90 bottom
SG1  62.23,10.16 270 bottom
SV1  72.39,34.29 90 bottom
T1  58.42,13.97 270 top
U1  0,19.68 90 bottom
U$2  23.47,16.69 0 top
X1  24.1,7.62 90 bottom
X2  58.34,27.65 90 top
X3  45.72,9.53 0 bottom
X4  63.5,57.15 90 bottom
X5  33.23,7.62 90 bottom
Y1  50.55,20.17 0 top
Y2  13.36,31.5 270 top

### Tracks (layer width: path | path; a pad name or v marks a point on that pad's centre or on a via)
3V
  Top 0.203: 47.09,33.86 IC3.55 47.09,29.82 46.23,28.96 C3.1 | 47.09,33.86 49.89,33.86 | 49.89,33.86 IC3.62 49.89,31.6 49.38,31.09 C4.1 | 44.86,36.09 IC3.46 41.71,36.09 40.56,34.94 C7.1 | 47.09,33.86 44.86,33.86 44.86,36.09 | 44.86,39.69 44.86,36.09 | 44.86,39.69 IC3.37 42.08,39.69 40.89,38.51 40.13,38.51 40.16,38.73 C8.1 | 49.89,33.86 55.73,33.86 55.73,38.49 IC3.86 65.13,38.49 C6.1 | C11.1 55.33,48.39 54.69,47.75 IC3.2 54.69,44.73 49.09,44.73 | R9.2 49.2,49.42 49.09,49.53 | C38.1 49.09,51.15 49.09,49.53 | 49.09,49.53 IC3.16 49.09,44.73 | 49.09,44.73 45.36,44.73 | 45.36,44.73 45.24,44.73 44.91,45.06 44.91,48.23 44.57,48.58 R18.1 | 45.36,44.73 45.36,40.2 44.86,39.69
  Top 0.269: 64.91,38.29 C6.1
  Top 0.305: R14.2 49.71,51.31 C38.1
  Top 0.406: 40.13,38.51 35.08,38.51 33.48,36.91 R10.2 | 33.47,35.87 R10.2 | R10.2 31.96,35.88 R7.2
3V_IN  (via drill 0.6 pad 1.42, 0.6 pad 1.78)
  Top 0.305: U$2.3 X1.2
  Top 0.406: C26.+ 17.74,14.86 18,14.61
  Top 0.457: L3.1 17.92,39 17.97,39 C19.1 | IC4.P$15 C19.1 | C19.1 C25.1 IC4.P$19 21.51,34.42 21.51,33.77 | C32.1 18,30.16 18.36,30.52 IC4.P$25 21.51,30.52 21.51,33.77 | IC4.P$28 C18.1 | IC4.P$20 21.51,33.77
  Top 0.508: C32.1 C18.1 v18,19.58 | R13.2 C31.1
  Top 0.61: C14.1 50.74,62.83 49.86,61.95 R14.1 | C15.+ 64.78,61.54 64.77,61.53 | U$2.7 U$2.8 21.57,17.84 R13.2 | v18,19.58 C31.1 18,14.61 v18,12.13
  Top 0.813: IC2.2 C14.1
  Top 1.016: IC2.2 IC2.TAB 60.71,61.53 64.77,61.53 73.09,61.53 78.11,56.52 78.11,13.34 67.94,3.17 41.49,3.17 35.77,8.89 X5.2 X1.2 19.68,8.89 18,10.58 v18,12.13
  Bottom 0.406: R11.2 16.19,19.9 15.88,19.59
  Bottom 0.457: C29.1 19.37,19.58 v18,19.58
  Bottom 0.61: U1.4 15.88,19.59 v17.99,19.59 v18,19.58 | R8.2 v18,12.13 19.47,12.13 R20.2 | JP3.4 37.34,24.64 33.23,20.54 X5.2
AN_3V
  Top 0.203: C9.1 41.14,43.64 42.29,42.49 IC3.30 44.86,42.49 44.86,44.37 44.53,44.7 43.38,44.7 43.18,44.91 R18.2
BUZZ
  Top 0.203: IC3.66 51.49,25.52 57.32,19.69 R15.2
CE1
  Top 0.406: R12.2 22.1,11.2 21.57,11.73 U$2.1
  Top 0.61: R13.1 21.57,16.14 U$2.1
D2_N
  Top 0.406: IC1.1 44.77,9.57 X3.2
D2_P
  Top 0.406: IC1.3 46.67,9.57 X3.3
D_N
  Top 0.203: IC1.6 44.77,14.52 45.49,15.24 45.49,27.27 47.49,29.27 IC3.56
D_P
  Top 0.203: IC1.4 46.67,14.52 45.95,15.24 45.95,27.08 47.89,29.03 IC3.57
ENC_CS
  Top 0.203: IC4.P$9 33.66,33.77 | 33.66,33.77 34.31,33.77 34.59,34.06 34.59,36.78 35.56,37.74 40.84,37.74 42.39,39.29 IC3.38 | R10.1 33.48,33.95 33.66,33.77
  Top 0.254: IC4.P$9
ENC_RST
  Top 0.305: IC4.P$10 31.81,34.42 R7.1
FLASH_CS
  Top 0.203: R12.1 28.4,11.2 29.03,11.84 29.03,17.6 31.11,19.68 40.64,19.68 42.22,21.26 42.22,29.08 43.48,30.35 45.26,30.35 46.29,31.38 IC3.53
GND  (via drill 0.5 pad 1.27, 0.6 pad 1.02, 0.6 pad 1.42)
  Top 0.203: IC3.75 55.09,31.95 v57.13,31.95 | IC3.65 51.09,25.11 51.84,24.36 v51.84,23.16 | IC3.15 49.49,47.65 50.37,48.53 50.37,50.26 51.23,51.11 | IC3.45 39.9,36.49 | IC3.31 40.66,42.09 C9.2 | IC3.36 41.46,40.09 41.17,39.8 C8.2
  Top 0.254: IC1.2 45.89,11.19 45.89,12.01 46.17,12.29 48.26,12.29 | C38.2 51.23,51.11
  Top 0.406: JP5.GND1 v43.78,63.01
  Top 0.457: IC4.P$11 25.73,35.08 | IC4.P$18 23.07,35.08 | IC4.P$21 18.36,33.12 | IC4.P$22 18.25,32.48 17.7,33.02 | IC4.P$2 29.32,29.23 v30.34,30.25
  other vias: 12.96,5.41 44.07,27.51 66.45,36.07 20.62,43.48 14.86,38.2 24.28,41.12 26.82,44.55 26.61,13.44 52.02,66.42 47.59,51.58 10.19,28.83 48.29,27.61 38.73,41.73 65.02,66.17 59.05,48.39 59.05,45.85 64.75,27.51 43.04,32.72 39.12,22.81 7.24,53.44
  pour Top (isolate 0.305, no thermals): 0,0 0,68.58 83.19,68.58 83.19,0
  pour Bottom (isolate 0.305, no thermals): 0,68.58 0,0 83.19,0 83.19,68.58
LED
  Top 0.203: IC3.67 51.89,25.83 56.77,20.95 R16.2
LEDA
  Top 0.406: IC4.P$27 21.51,29.23 21.51,26.52 20.83,25.83 R19.1
LEDB
  Top 0.406: IC4.P$26 22.4,29.88 22.4,25.02 20.68,23.29 R17.2
MCLR
  Top 0.203: R9.1 51.22,48.56 50.29,47.64 IC3.13
  Top 0.254: C28.1
  Top 0.305: R9.1 51.62,49.82 51.9,49.82 52.94,50.86 C28.1
  Top 0.406: JP2.1 56.03,54.52 54.18,52.67 C28.1
MISO  (via drill 0.6 pad 1.42)
  Top 0.203: IC3.49 42.64,34.89 39.27,31.52 39.27,29.87 38.51,29.11 36.04,29.11 34.9,30.25 34.9,30.96 34.59,31.28 33.01,31.28 32.46,31.82 IC4.P$6
  Top 0.305: U$2.2 22.84,16.1 23.8,17.07 25.86,17.07 26.64,17.86 v26.64,22.86 26.64,24.41 26.24,24.82 26.24,31.5 26.57,31.83 26.57,31.82 IC4.P$6
  Bottom 0.305: U1.7 20.32,16.29 | 20.32,16.29 21.57,16.29 26.64,21.36 v26.64,22.86 26.64,21.59 | R20.1 20.32,16.29
MOSI  (via drill 0.6 pad 1.42)
  Top 0.305: U$2.5 v25.38,24.03 25.38,31.65 26.2,32.48 IC4.P$7 33.48,32.48 R1.2
  Bottom 0.305: v25.38,24.03 23.62,24.03 20.34,20.75 14.37,20.75 U1.3
N$1
  Top 0.813: T1.3 SG1.-
N$2
  Top 0.61: R3.2 28.08,41.09 28,41.09 C16.2 R2.1
N$3
  Top 0.61: R15.1 T1.1
N$4
  Top 0.61: R16.1 LED1.A
N$5
  Top 0.203: IC3.50 42.95,34.49 39.78,31.32 39.78,27.86 38.58,26.67 36.09,26.67 35.41,27.36 35.41,28.91 33.88,30.43 R1.1
N$6
  Top 0.254: RJ1.P4 25.93,51.87 24.59,53.21 20.85,53.21 20.17,52.53 20.17,44.6 19.57,44.01 R5.1
  Top 0.61: R4.2 19.57,39.24 R5.1 L3.2 | L3.2 | C17.2 L3.2
N$8  (via drill 0.6 pad 1.27)
  other vias: 78.19,5
N$9  (via drill 0.6 pad 1.27)
  other vias: 78.19,63.58
N$10
  Top 0.203: IC3.85 63.26,38.09 C10.1
N$11  (via drill 0.6 pad 1.27)
  other vias: 5,63.58
N$12
  Top 0.406: IC4.P$14 26.78,37.02 26.22,37.58 R6.2
N$17
  Top 0.406: JP5.VBUS1 F1.1
N$22
  Top 0.305: IC4.P$23 12.22,31.82 | 12.22,31.82 11.43,31.82 10.8,32.46 C21.1 | Y2.1 12.21,31.83 12.22,31.82
N$23
  Top 0.305: IC4.P$24 14.53,31.18 | 14.53,31.18 11.44,31.18 10.8,30.54 C22.1 | Y2.3 14.51,31.16 14.53,31.18
N$29
  Top 0.457: IC4.P$1 30.19,28.57 C24.+
N$30
  Top 0.406: RJ1.Y+ 31.8,63.93 18.14,63.93 14.78,60.58 14.78,49.02 5.46,39.7 5.46,28.25 8.69,25.02 13.46,25.02 15.19,23.29 R17.1
N$31
  Top 0.406: R19.2 9.02,25.83 6.27,28.57 6.27,39.37 15.6,48.69 15.6,60.25 17.91,62.56 RJ1.G+
N$36  (via drill 0.6 pad 1.27)
  other vias: 5,5
OSC1
  Top 0.203: Y1.1 50.26,19.02 50.29,19.05 | C2.1 49.66,17.78 50.29,18.41 50.29,19.05 | IC3.63 50.29,19.05
OSC2
  Top 0.203: Y1.3 50.7,21.32 50.69,21.31 | C1.1 51.43,17.78 50.69,18.52 50.69,21.31 | IC3.64 50.69,21.31
PGEC
  Top 0.203: IC3.24 45.89,55.7 JP2.5
PGED
  Top 0.203: JP2.4 48.41,56.36 47.62,57.15 45.34,57.15 44.6,56.41 44.6,53.49 45.49,52.6 IC3.25
RA6
  Top 0.203: IC3.91 67.86,40.49 68.86,39.5 68.86,38.38 69.88,37.36 69.88,36.27 70.59,35.56 72.39,35.56 SV1.20
RA7
  Top 0.203: IC3.92 68.17,40.89 69.37,39.7 69.37,38.58 SV1.19
RC1
  Top 0.203: IC3.6 53.09,49.41 54.74,51.05 68.35,51.05 70.64,53.34 72.39,53.34 SV1.34
RC2
  Top 0.203: SV1.33 68.07,51.56 54.53,51.56 52.69,49.72 52.69,48.25 51.89,47.45 IC3.9
RD0
  Top 0.203: IC3.72 53.89,27.39 57.15,24.13 66.45,24.13 68.86,21.72 68.86,20.6 69.88,19.58 69.88,18.49 70.59,17.78 72.39,17.78 SV1.6
RD1
  Top 0.203: IC3.76 57.73,34.49 61.47,30.76 65,30.76 65.3,30.45 65.3,29.34 66.32,28.32 66.32,27.2 67.33,26.19 67.33,25.07 68.35,24.05 68.35,22.94 69.37,21.92 69.37,20.8 SV1.5
RD2
  Top 0.203: IC3.77 58.07,34.89 61.7,31.27 65.2,31.27 65.81,30.66 65.81,29.54 66.83,28.52 66.83,27.41 67.84,26.39 67.84,25.27 68.86,24.26 68.86,23.14 69.88,22.12 69.88,21.03 70.59,20.32 72.39,20.32 SV1.8
RD3
  Top 0.203: IC3.78 58.38,35.29 61.9,31.77 65.41,31.77 66.32,30.86 66.32,29.74 67.33,28.73 67.33,27.61 68.35,26.59 68.35,25.48 69.37,24.46 69.37,23.34 SV1.7
RD4
  Top 0.203: SV1.12 72.39,25.4 70.59,25.4 69.88,26.11 69.88,27.2 68.86,28.22 68.86,29.34 67.84,30.35 67.84,31.47 66.02,33.3 62.51,33.3 59.31,36.49 IC3.81
RD5
  Top 0.203: SV1.11 69.37,28.42 69.37,29.54 68.35,30.56 68.35,31.67 66.22,33.81 62.71,33.81 59.63,36.89 IC3.82
RD6
  Top 0.203: SV1.14 72.39,27.94 70.59,27.94 69.88,28.65 69.88,29.74 68.86,30.76 68.86,31.88 66.42,34.31 62.92,34.31 59.94,37.29 IC3.83
RD7
  Top 0.203: SV1.13 69.37,30.96 69.37,32.08 66.62,34.82 63.12,34.82 60.25,37.69 IC3.84
RD8
  Top 0.203: IC3.68 52.29,26.14 56.34,22.1 65.63,22.1 66.83,20.9 66.83,19.79 67.84,18.77 67.84,17.65 68.86,16.64 68.86,15.52 69.88,14.5 69.88,13.46 70.61,12.72 72.42,12.72 SV1.2
RD9
  Top 0.203: IC3.69 52.69,26.45 56.54,22.61 65.84,22.61 67.33,21.11 67.33,19.99 68.35,18.97 68.35,17.86 69.37,16.84 69.37,15.72 SV1.1
RD10
  Top 0.203: IC3.70 53.09,26.77 56.74,23.11 66.04,23.11 67.84,21.31 67.84,20.19 68.86,19.18 68.86,18.06 69.88,17.04 69.88,15.95 70.59,15.24 72.39,15.24 SV1.4
RD11
  Top 0.203: IC3.71 53.49,27.08 56.95,23.62 66.24,23.62 68.35,21.51 68.35,20.4 69.37,19.38 69.37,18.26 SV1.3
RD12
  Top 0.203: IC3.79 58.69,35.69 62.1,32.28 65.61,32.28 66.83,31.06 66.83,29.95 67.84,28.93 67.84,27.81 68.86,26.8 68.86,25.68 69.88,24.66 69.88,23.57 70.59,22.86 72.39,22.86 SV1.10
RD13
  Top 0.203: IC3.80 59,36.09 62.31,32.79 65.81,32.79 67.33,31.27 67.33,30.15 68.35,29.13 68.35,28.02 69.37,27 69.37,25.88 SV1.9
RE0
  Top 0.203: IC3.93 68.48,41.29 69.88,39.9 69.88,38.81 70.59,38.1 72.39,38.1 SV1.22
RE1
  Top 0.203: IC3.94 68.8,41.69 SV1.21
RE2
  Top 0.203: IC3.98 69.96,43.29 SV1.25
RE3
  Top 0.203: SV1.28 72.39,45.72 70.61,45.72 68.59,43.69 IC3.99
RE4
  Top 0.203: IC3.100 68.22,44.09 SV1.27
RE5
  Top 0.203: SV1.29 55.35,49.53 54.29,48.48 IC3.3
RE6
  Top 0.203: IC3.4 53.89,48.79 55.14,50.04 69.88,50.04 70.64,50.8 72.39,50.8 SV1.32
RE7
  Top 0.203: IC3.5 53.49,49.1 54.94,50.55 69.6,50.55 SV1.31
RF0
  Top 0.203: IC3.87 66.62,38.89 66.83,38.68 66.83,37.57 67.84,36.55 67.84,35.43 68.86,34.42 68.86,33.3 69.88,32.28 69.88,31.19 70.59,30.48 72.39,30.48 SV1.16
RF1
  Top 0.203: IC3.88 66.93,39.29 67.33,38.89 67.33,37.77 68.35,36.75 68.35,35.64 69.37,34.62 69.37,33.5 SV1.15
RG0
  Top 0.203: IC3.90 67.55,40.09 68.35,39.29 68.35,38.18 69.37,37.16 69.37,36.04 SV1.17
RG1
  Top 0.203: IC3.89 67.24,39.69 67.84,39.09 67.84,37.97 68.86,36.96 68.86,35.84 69.88,34.82 69.88,33.73 70.59,33.02 72.39,33.02 SV1.18
RG12
  Top 0.203: IC3.96 69.9,42.49 70.48,41.91 SV1.23
RG13
  Top 0.203: SV1.26 72.36,43.16 70.59,43.16 70.33,42.89 IC3.97
RG14
  Top 0.203: IC3.95 69.16,42.09 70.64,40.62 72.36,40.62 SV1.24
RG15
  Top 0.203: IC3.1 55.09,46.86 55.45,47.22 69.09,47.22 70.13,48.26 72.39,48.26 SV1.30
RXD
  Top 0.203: IC3.47 42.02,35.69 40.51,34.19 36.2,34.19 35.41,33.4 35.41,30.63 35.66,30.38 JP3.3
SCK  (via drill 0.6 pad 1.42)
  Top 0.203: IC4.P$8 34.4,33.12 35.1,33.83 35.1,36.58 35.75,37.22 41.03,37.22 42.7,38.89 IC3.39
  Top 0.305: IC4.P$8 25.84,33.12 24.11,31.39 v24.11,22.86 U$2.6
  Bottom 0.305: U1.5 14.37,18.41 21.57,18.41 24.11,20.95 v24.11,22.86
SD_CS  (via drill 0.6 pad 1.42)
  Top 0.203: IC3.51 45.49,31.95 44.91,31.37 43.08,31.37 41.2,29.49 41.2,26.59 39.8,25.2 v27.53,25.2
  Bottom 0.305: U1.2 15.88,21.79 20.52,21.79 23.93,25.2 v27.53,25.2
  Bottom 0.406: R11.1 16.06,21.6 15.88,21.79
SD_PRESENT  (via drill 0.6 pad 1.42)
  Top 0.203: v30,20.19 40.44,20.19 41.71,21.46 41.71,29.29 43.28,30.86 45.06,30.86 45.89,31.69 IC3.52
  Bottom 0.305: R8.1 23.63,13.83 v30,20.19
  Bottom 0.61: U1.CD1 R8.1
SOSCI
  Top 0.203: X2.1 56.63,26.4 54.29,28.74 IC3.73
  Top 0.406: X2.1 C20.2
SOSCO
  Top 0.203: IC3.74 54.69,30.4 56.19,28.9 X2.2
  Top 0.406: X2.2 C23.2
TPIN_N
  Top 0.254: IC4.P$12 29.62,35.73 30.63,36.73 30.63,41.3 | RJ1.RD- 30.63,46.56 30.63,46.18 arc90 31.01,45.8 31.93,45.8 arc-90 32.31,45.41 32.31,45.37 arc-90 31.93,44.99 31.01,44.99 arc90 30.63,44.61 30.63,44.56 arc90 31.01,44.18 31.93,44.18 arc-90 32.31,43.8 32.31,43.76 arc-90 31.93,43.38 31.01,43.38 arc90 30.63,42.99 30.63,41.3 | R2.2 30.66,41.27 30.63,41.3
TPIN_P
  Top 0.254: IC4.P$13 29.63,36.38 30.18,36.92 30.18,39.55 | 30.18,39.55 30.18,46.38 29.13,47.42 25.4,47.42 24.66,48.16 RJ1.RD+ | R3.1 29.87,39.24 30.18,39.55
TPOUT_N
  Top 0.254: R5.2 21.67,41.17 | 21.67,41.17 21.67,49.38 20.83,50.22 20.83,52.25 21.13,52.55 23.11,52.55 23.39,52.27 RJ1.TD- | 21.67,41.17 21.67,36.75 21.29,36.38 IC4.P$16
TPOUT_P
  Top 0.254: 22.12,39.14 22.12,36.56 21.29,35.73 IC4.P$17 | R4.1 22.12,39.14 | 22.12,39.14 22.12,43.02 arc-90 22.5,43.41 23.79,43.41 arc90 24.17,43.79 24.17,43.8 arc90 23.79,44.18 22.5,44.18 arc-90 22.12,44.56 22.12,44.57 arc-90 22.5,44.95 23.79,44.95 arc90 24.17,45.33 24.17,45.34 arc90 23.79,45.72 22.5,45.72 arc-90 22.12,46.1 RJ1.TD+
TXD
  Top 0.203: IC3.48 42.33,35.29 39.95,32.92 JP3.2
VBUS
  Top 0.203: 42.73,12.29 42.73,28.89 43.69,29.84 45.47,29.84 46.69,31.07 IC3.54
  Top 0.254: IC1.5 45.55,13.49 45.55,12.58 45.26,12.29 42.73,12.29
  Top 0.305: C5.+ 51.43,6.35 51.44,6.35
  Top 0.406: X3.1 42.22,11.79 42.73,12.29 | C13.1 52.06,60.52 52.07,60.52 | C30.+
  Top 0.61: F1.2 52.07,60.52
  Top 0.813: C12.+ F1.2 | 52.07,60.52 54.5,60.52 IC2.3 54.51,58.42 X4.2 73.03,58.42 76.2,55.24 76.2,13.97 68.58,6.35 C30.+ SG1.+ C5.+ | 51.44,6.35 42.22,6.35 C27.1 X3.1